# EAGLE design ESP32 IN14 Clock (EAGLE 8.2.1)

## Sheet 1 of 3
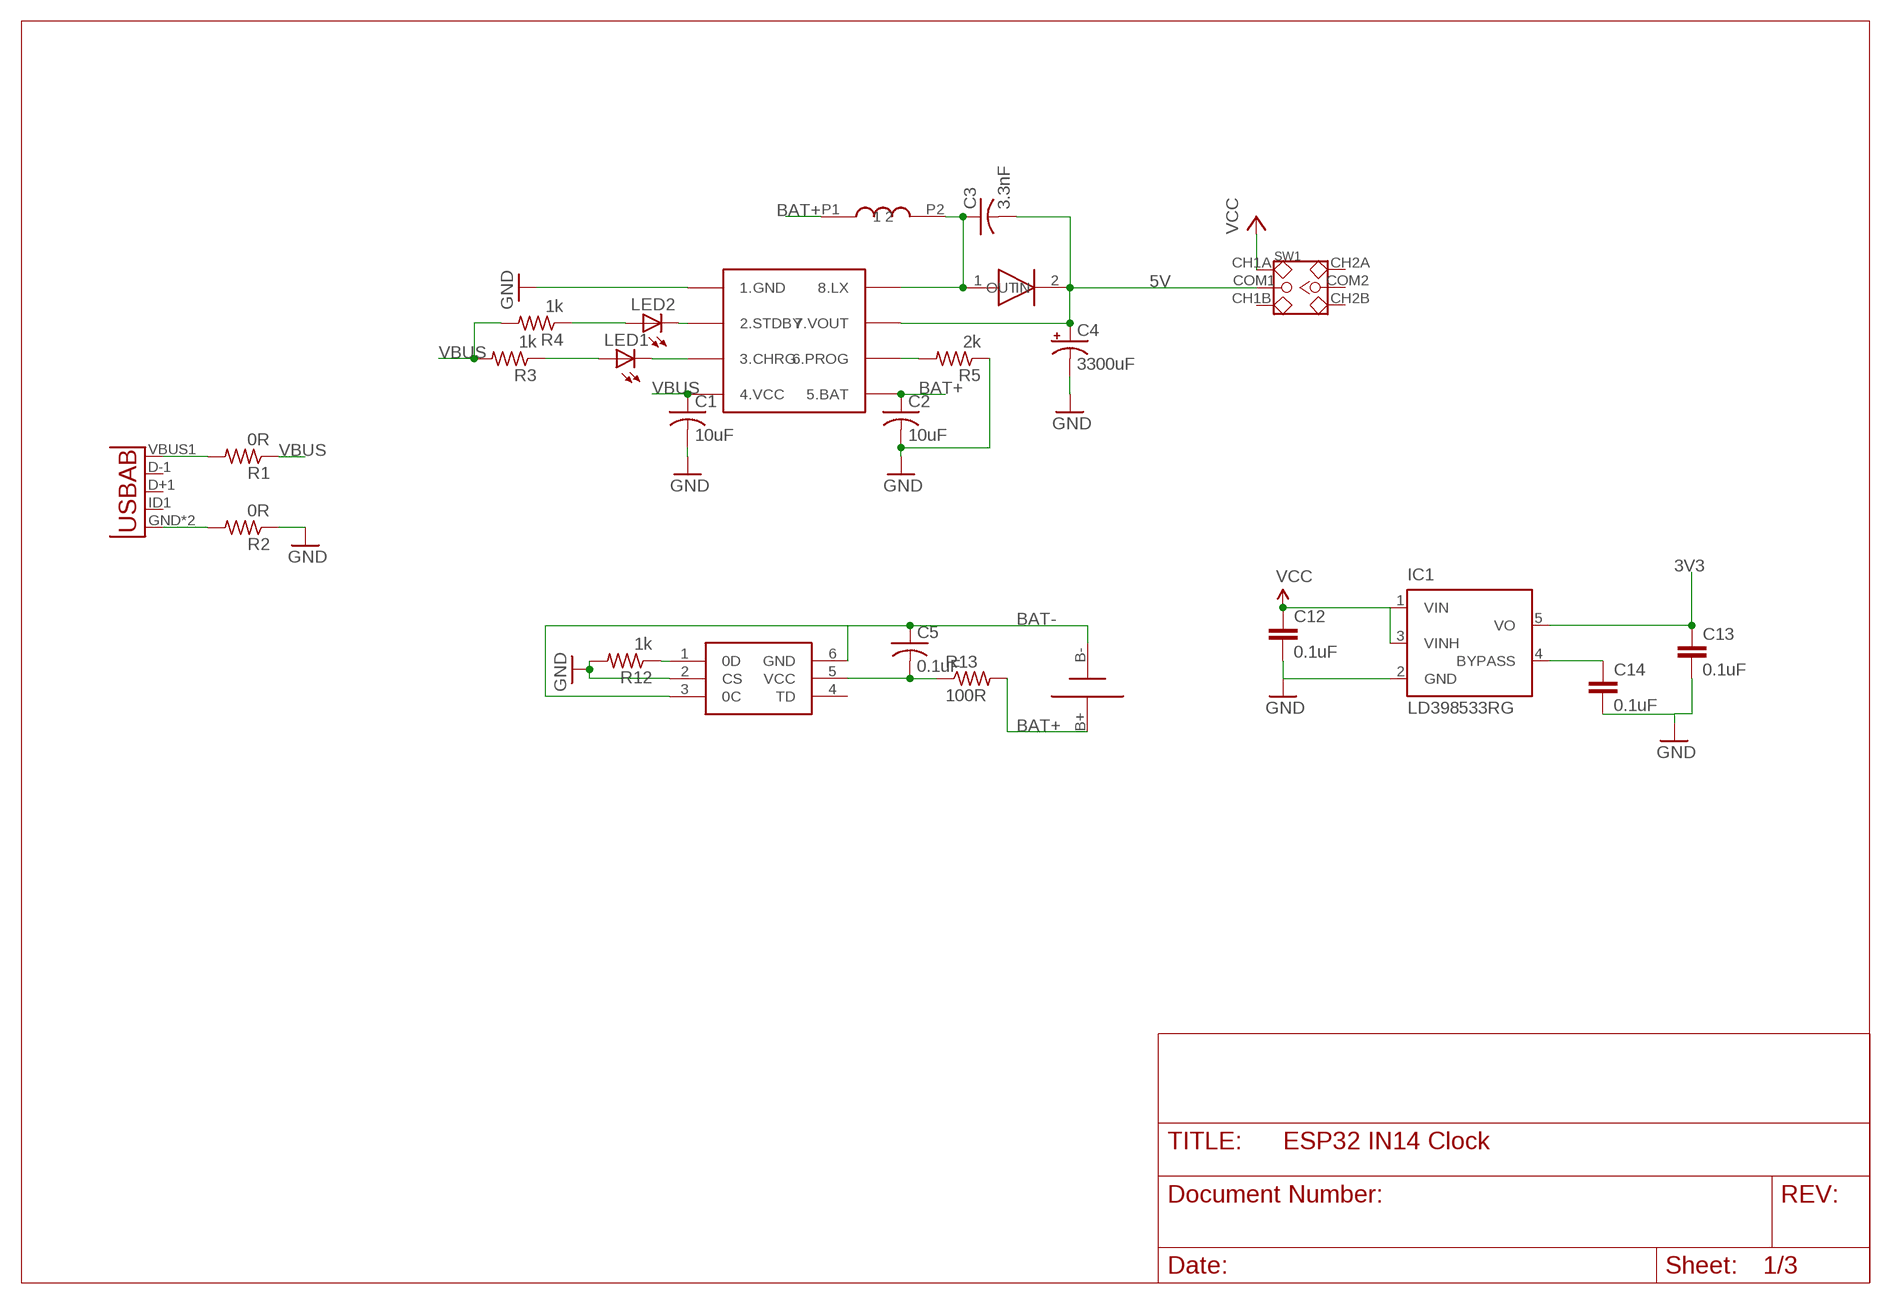
[diagram p0: schematic, sheet 1]

### Parts
C1  10uF  C-USC1206  [C1206]
C2  10uF  C-USC1206  [C1206]
C3  3.3nF  C-USC1206  [C1206]
C4  3300uF  CPOL-USE7.5-18  [E7,5-18]
C5  0.1uF  C-USC1206  [C1206]
C12  0.1uF  2.2UF-CERCAP-10009  [1206]
C13  0.1uF  2.2UF-CERCAP-10009  [1206]
C14  0.1uF  2.2UF-CERCAP-10009  [1206]
IC1  LD398533RG  [TSOT23-5L]
L2  3.3uH  CD54  [CD54]
LED1  LEDCHIPLED_0805  [CHIPLED_0805]
LED2  LEDCHIPLED_0805  [CHIPLED_0805]
R1  0R  R-US_M0805  [M0805]
R2  0R  R-US_M0805  [M0805]
R3  1k  R-US_M0805  [M0805]
R4  1k  R-US_M0805  [M0805]
R5  2k  R-US_M0805  [M0805]
R12  1k  R-US_M0805  [M0805]
R13  100R  R-US_M0805  [M0805]
SW1  SMD-TOGGLE-SWITCH-2CH(2X3P-7X3.5MM)  [SW6-2.54-SMD-7.0X3.5X1.5MM]
U1  USB""  [USB-MICRO-SMD]
U2  FM6316FE  [SOP-8]
U3  DW06  [SOT23-6]
U$1  SMA-SS34  [SMA-SS34]
U$2  18650SMD  [18650SMD]

### Nets
3V3: C13.1 IC1.5(VO) ; also sheet 2
5V: C3.2 C4.+ SW1.COM1 U2.7(7.VOUT) U$1.2(OUT)
BAT+: C2.1 L2.P1 R13.2 U2.5(5.BAT) U$2.B+
BAT-: C5.1 U3.3(0C) U3.6(GND) U$2.B-
GND: C1.2 C2.2 C4.- C12.2 C13.2 C14.2 IC1.2(GND) R2.1 R5.1 R12.2 U2.1(1.GND) U3.2(CS) ; also sheet 2,3
N$1: R1.2 U1.VBUS1(VBUS)
N$2: R2.2 U1.GND U1.GND1(GND)
N$3: LED1.C U2.3(3.CHRG)
N$4: LED1.A R3.1
N$5: LED2.C U2.2(2.STDBY)
N$6: R5.2 U2.6(6.PROG)
N$7: C3.1 L2.P2 U2.8(8.LX) U$1.1(IN)
N$8: R12.1 U3.1(0D)
N$9: C5.2 R13.1 U3.5(VCC)
N$13: C14.1 IC1.4(BYPASS)
N$18: LED2.A R4.1
VBUS: C1.1 R1.1 R3.2 R4.2 U2.4(4.VCC)
VCC: C12.1 IC1.1(VIN) IC1.3(VINH) SW1.CH1A ; also sheet 2,3
Unconnected: SW1.CH1B SW1.CH2A SW1.CH2B SW1.COM2 U1.D+1(D+) U1.D-1(D-) U1.ID1(USBID) U3.4(TD)

## Sheet 2 of 3
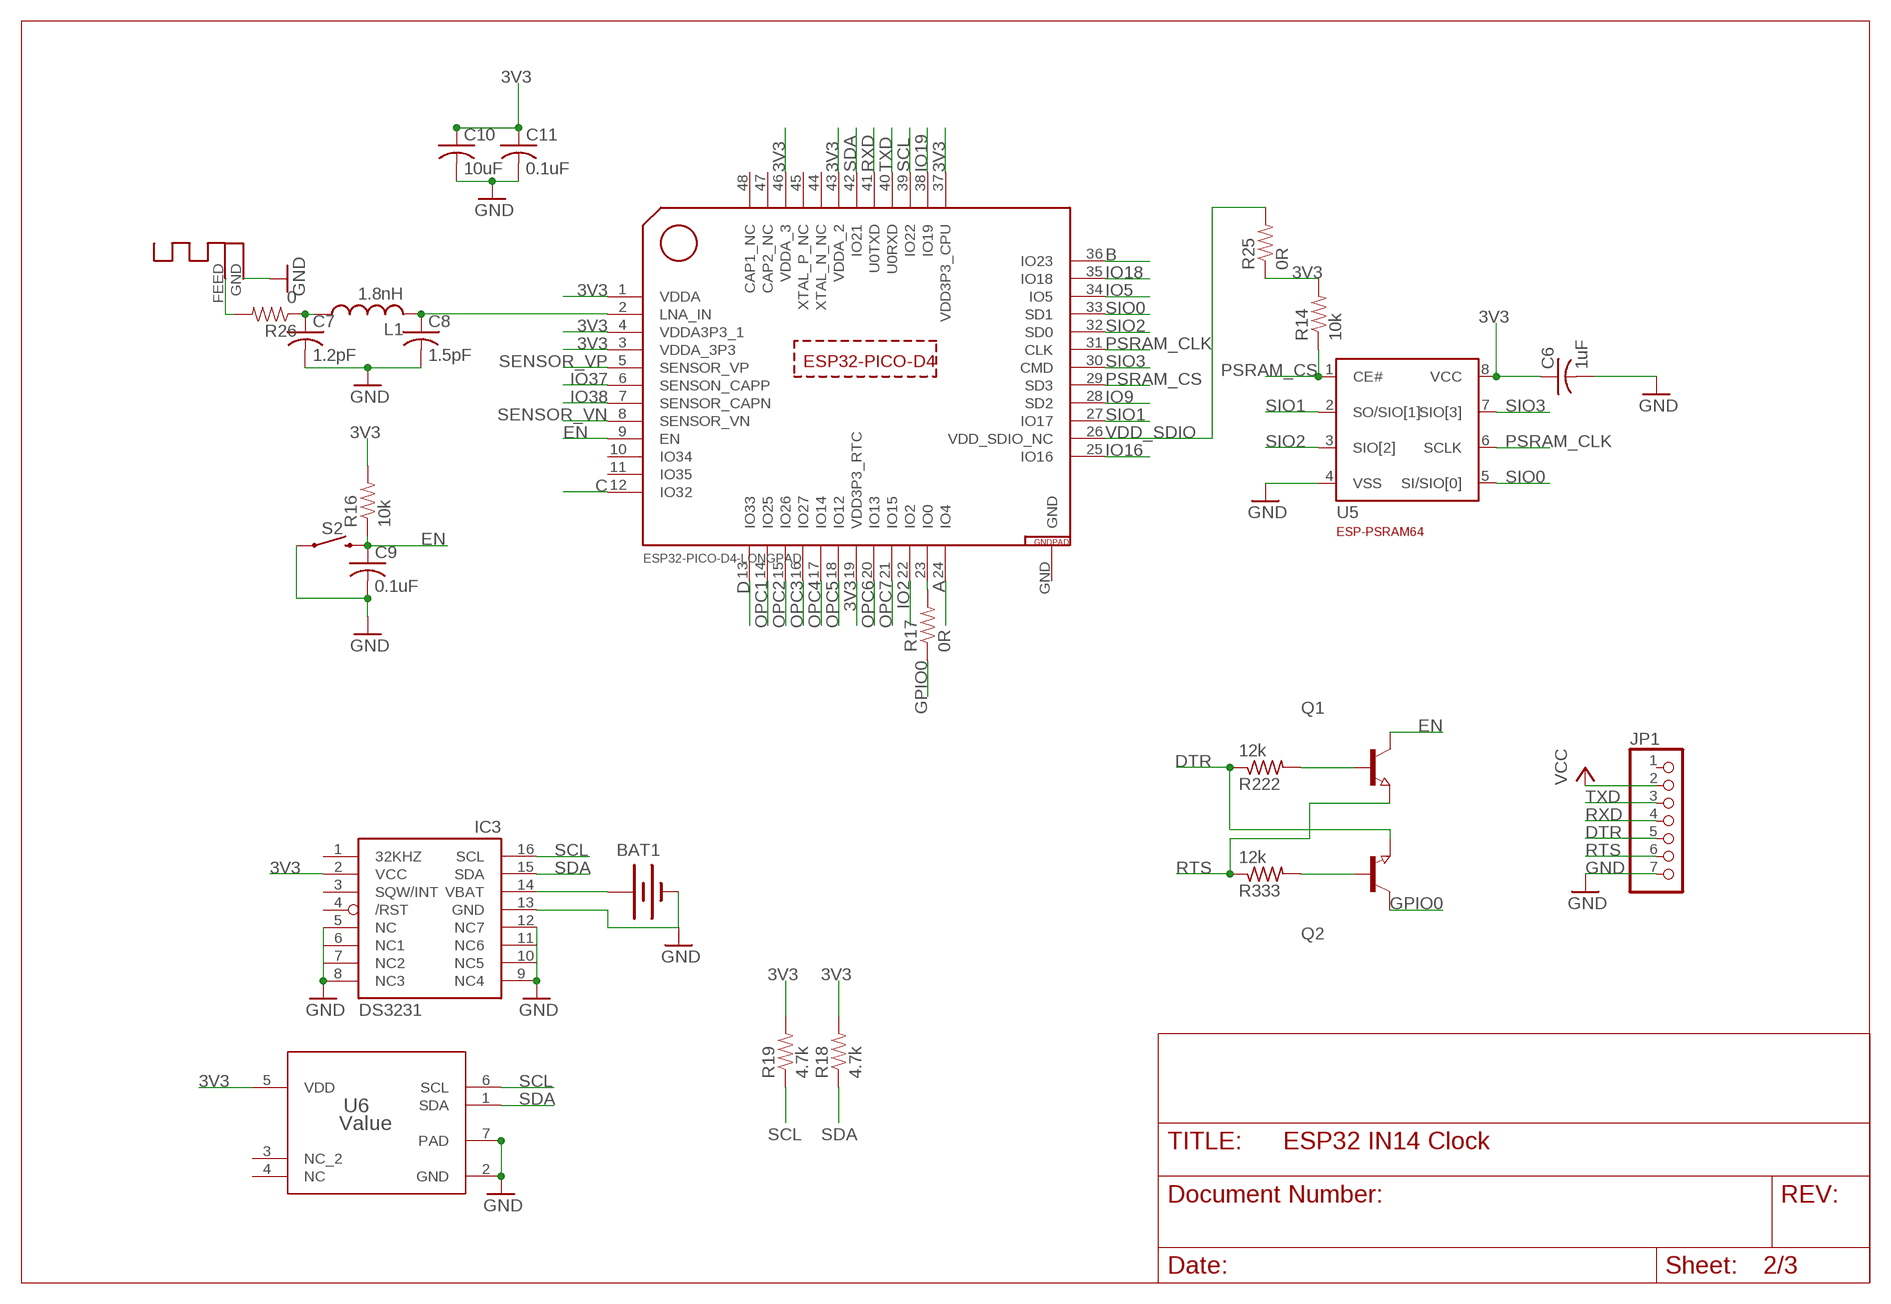
[diagram p1: schematic, sheet 2]

### Parts
ANT1  ANTENNA  [RN-ANT]
BAT1  BATTERY20PTH  [BATTCOM_20MM_PTH]
C6  1uF  C-USC1206  [C1206]
C7  1.2pF  C-USC1206  [C1206]
C8  1.5pF  C-USC1206  [C1206]
C9  0.1uF  C-USC1206  [C1206]
C10  10uF  C-USC1206  [C1206]
C11  0.1uF  C-USC1206  [C1206]
IC3  DS3231/SO  [SO16W]
JP1  PINHD-1X7  [1X07]
L1  1.8nH  INDUCTOR_0805_L  [RESC0805_L]
Q1  NPN-TRANSISTOR_SOT23W  [SOT23W]
Q2  NPN-TRANSISTOR_SOT23W  [SOT23W]
R14  10k  100OHM1/10W1%(0603)  [0603-RES]
R16  10k  100OHM1/10W1%(0603)  [0603-RES]
R17  0R  100OHM1/10W1%(0603)  [0603-RES]
R18  4.7k  1.2MOHMS-1/10W-1%(0603)  [0603-RES]
R19  4.7k  1.2MOHMS-1/10W-1%(0603)  [0603-RES]
R25  0R  100OHM1/10W1%(0603)  [0603-RES]
R26  0  100OHM1/10W1%(0603)  [0603-RES]
R222  12k  R-US_M0805  [M0805]
R333  12k  R-US_M0805  [M0805]
S2  MOMENTARY-SWITCH-SPST-SMD-6.0X3.5MM  [TACTILE_SWITCH_SMD_6.0X3.5MM]
U4  ESP32-PICO-D4-LONGPAD  [QFN48]
U5  ESP-PSRAM64  [SOT23-8]
U6  Value  HDC1080DMBR  [DMB0006A]

### Nets
3V3: C6.1 C10.1 C11.1 IC3.2(VCC) R14.2 R16.2 R18.2 R19.2 R25.1 U4.1(VDDA) U4.3(VDDA_3P3) U4.4(VDDA3P3_1) U4.19(VDD3P3_RTC) U4.37(VDD3P3_CPU) U4.43(VDDA_2) U4.46(VDDA_3) U5.8(VCC) U6.5(VDD) ; also sheet 1
A: U4.24(IO4) ; also sheet 3
B: U4.36(IO23) ; also sheet 3
C: U4.12(IO32) ; also sheet 3
D: U4.13(IO33) ; also sheet 3
DTR: JP1.5 Q2.3(E) R222.1
EN: C9.1 Q1.2(C) R16.1 S2.2 U4.9(EN)
GND: ANT1.GND BAT1.2(-) C6.2 C7.2 C8.2 C9.2 C10.2 C11.2 IC3.5(NC) IC3.6(NC1) IC3.7(NC2) IC3.8(NC3) IC3.9(NC4) IC3.10(NC5) IC3.11(NC6) IC3.12(NC7) IC3.13(GND) JP1.7 S2.1 U5.4(VSS) U6.2(GND) U6.7(PAD) ; also sheet 1,3
GPIO0: Q2.2(C) R17.1
IO2: U4.22(IO2)
IO5: U4.34(IO5)
IO9: U4.28(SD2)
IO16: U4.25(IO16)
IO18: U4.35(IO18)
IO19: U4.38(IO19)
IO37: U4.6(SENSON_CAPP)
IO38: U4.7(SENSOR_CAPN)
N$10: ANT1.FEED R26.2
N$11: R17.2 U4.23(IO0)
N$12: Q1.1(B) R222.2
N$14: Q2.1(B) R333.2
N$15: C8.1 L1.2 U4.2(LNA_IN)
N$16: C7.1 L1.1 R26.1
N$17: BAT1.1(+) IC3.14(VBAT)
OPC1: U4.14(IO25) ; also sheet 3
OPC2: U4.15(IO26) ; also sheet 3
OPC3: U4.16(IO27) ; also sheet 3
OPC4: U4.17(IO14) ; also sheet 3
OPC5: U4.18(IO12) ; also sheet 3
OPC6: U4.20(IO13) ; also sheet 3
OPC7: U4.21(IO15) ; also sheet 3
PSRAM_CLK: U4.31(CLK) U5.6(SCLK)
PSRAM_CS: R14.1 U4.29(SD3) U5.1(CE#)
RTS: JP1.6 Q1.3(E) R333.1
RXD: JP1.4 U4.41(U0TXD)
SCL: IC3.16(SCL) R19.1 U4.39(IO22) U6.6(SCL)
SDA: IC3.15(SDA) R18.1 U4.42(IO21) U6.1(SDA)
SENSOR_VN: U4.8(SENSOR_VN)
SENSOR_VP: U4.5(SENSOR_VP)
SIO0: U4.33(SD1) U5.5(SI/SIO[0])
SIO1: U4.27(IO17) U5.2(SO/SIO[1])
SIO2: U4.32(SD0) U5.3(SIO[2])
SIO3: U4.30(CMD) U5.7(SIO[3])
TXD: JP1.3 U4.40(U0RXD)
VCC: JP1.2 ; also sheet 1,3
VDD_SDIO: R25.2 U4.26(VDD_SDIO_NC)
Unconnected: IC3.1(32KHZ) IC3.3(SQW/INT) IC3.4(/RST) JP1.1 U4.10(IO34) U4.11(IO35) U4.44(XTAL_N_NC) U4.45(XTAL_P_NC) U4.47(CAP2_NC) U4.48(CAP1_NC) U6.3(NC_2) U6.4(NC)

## Sheet 3 of 3
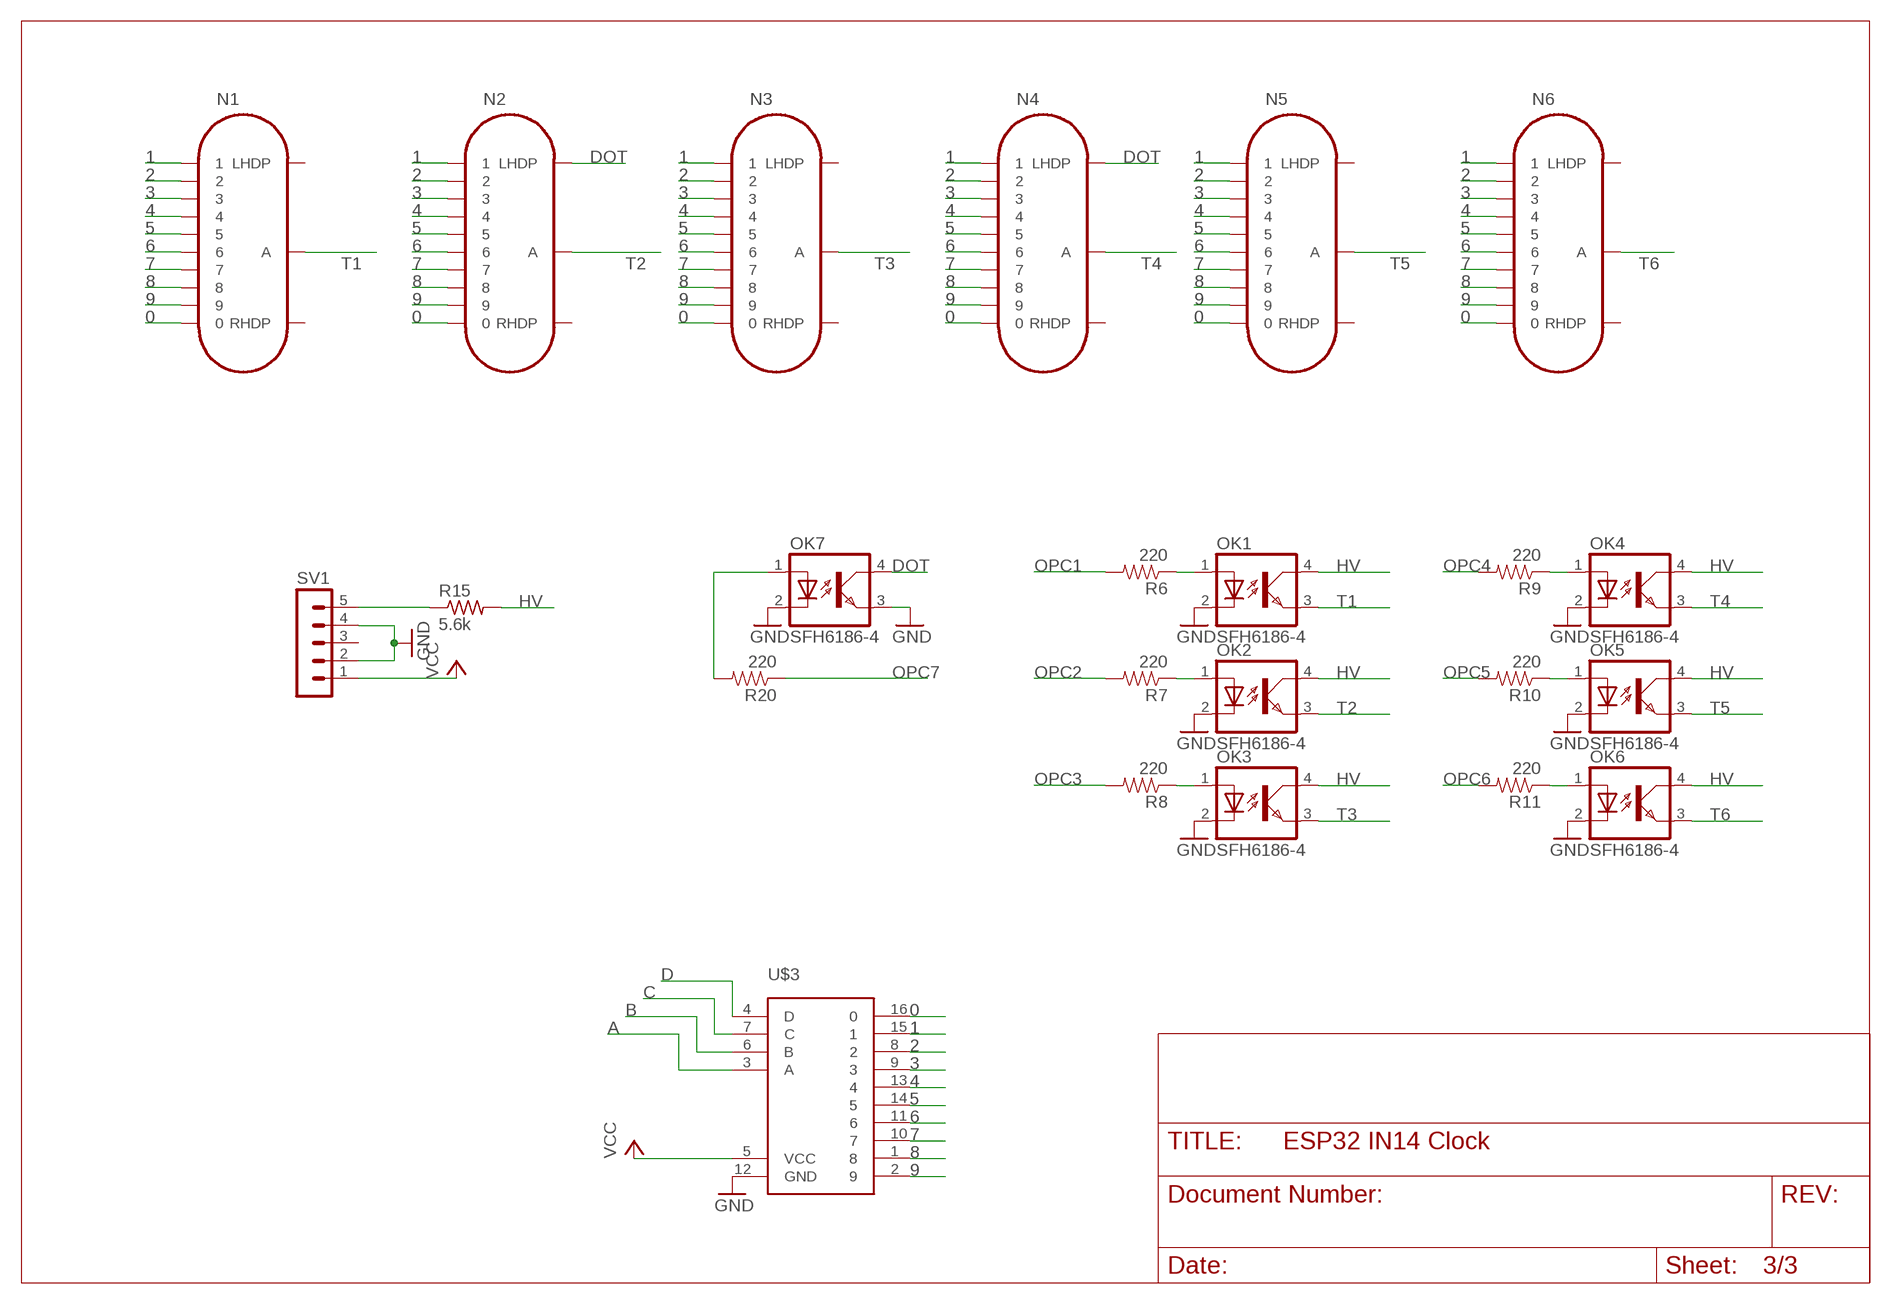
[diagram p2: schematic, sheet 3]

### Parts
N1  IN-14  [IN-14]
N2  IN-14  [IN-14]
N3  IN-14  [IN-14]
N4  IN-14  [IN-14]
N5  IN-14  [IN-14]
N6  IN-14  [IN-14]
OK1  SFH6186-4  [SMD4-7]
OK2  SFH6186-4  [SMD4-7]
OK3  SFH6186-4  [SMD4-7]
OK4  SFH6186-4  [SMD4-7]
OK5  SFH6186-4  [SMD4-7]
OK6  SFH6186-4  [SMD4-7]
OK7  SFH6186-4  [SMD4-7]
R6  220  1.2MOHMS-1/10W-1%(0603)  [0603-RES]
R7  220  1.2MOHMS-1/10W-1%(0603)  [0603-RES]
R8  220  1.2MOHMS-1/10W-1%(0603)  [0603-RES]
R9  220  1.2MOHMS-1/10W-1%(0603)  [0603-RES]
R10  220  1.2MOHMS-1/10W-1%(0603)  [0603-RES]
R11  220  1.2MOHMS-1/10W-1%(0603)  [0603-RES]
R15  5.6k  R-US_0207/12  [0207/12]
R20  220  1.2MOHMS-1/10W-1%(0603)  [0603-RES]
SV1  MA05-1  [MA05-1]
U$3  K155ID1  [DIL16-KIT]

### Nets
0: N1.0 N2.0 N3.0 N4.0 N5.0 N6.0 U$3.16
1: N1.1 N2.1 N3.1 N4.1 N5.1 N6.1 U$3.15
2: N1.2 N2.2 N3.2 N4.2 N5.2 N6.2 U$3.8
3: N1.3 N2.3 N3.3 N4.3 N5.3 N6.3 U$3.9
4: N1.4 N2.4 N3.4 N4.4 N5.4 N6.4 U$3.13
5: N1.5 N2.5 N3.5 N4.5 N5.5 N6.5 U$3.14
6: N1.6 N2.6 N3.6 N4.6 N5.6 N6.6 U$3.11
7: N1.7 N2.7 N3.7 N4.7 N5.7 N6.7 U$3.10
8: N1.8 N2.8 N3.8 N4.8 N5.8 N6.8 U$3.1
9: N1.9 N2.9 N3.9 N4.9 N5.9 N6.9 U$3.2
A: U$3.3(A) ; also sheet 2
B: U$3.6(B) ; also sheet 2
C: U$3.7(C) ; also sheet 2
D: U$3.4(D) ; also sheet 2
DOT: N2.LHDP N4.LHDP OK7.4(COL)
GND: OK1.2(C) OK2.2(C) OK3.2(C) OK4.2(C) OK5.2(C) OK6.2(C) OK7.2(C) OK7.3(EMIT) SV1.2 SV1.4 U$3.12(GND) ; also sheet 1,2
HV: OK1.4(COL) OK2.4(COL) OK3.4(COL) OK4.4(COL) OK5.4(COL) OK6.4(COL) R15.2
N$19: R15.1 SV1.5
N$22: OK1.1(A) R6.1
N$23: OK2.1(A) R7.1
N$24: OK3.1(A) R8.1
N$25: OK4.1(A) R9.1
N$26: OK5.1(A) R10.1
N$27: OK6.1(A) R11.1
N$40: OK7.1(A) R20.2
OPC1: R6.2 ; also sheet 2
OPC2: R7.2 ; also sheet 2
OPC3: R8.2 ; also sheet 2
OPC4: R9.2 ; also sheet 2
OPC5: R10.2 ; also sheet 2
OPC6: R11.2 ; also sheet 2
OPC7: R20.1 ; also sheet 2
T1: N1.A OK1.3(EMIT)
T2: N2.A OK2.3(EMIT)
T3: N3.A OK3.3(EMIT)
T4: N4.A OK4.3(EMIT)
T5: N5.A OK5.3(EMIT)
T6: N6.A OK6.3(EMIT)
VCC: SV1.1 U$3.5(VCC) ; also sheet 1,2
Unconnected: N1.LHDP N1.RHDP N2.RHDP N3.LHDP N3.RHDP N4.RHDP N5.LHDP N5.RHDP N6.LHDP N6.RHDP SV1.3

## Power pins joined to a net without a drawn wire
GND: U4.GND

## Library data of the parts
ANT1 = adafruit:ANTENNA
BAT1 = SparkFun-Electromechanical:BATTERY: Battery Holders Various common sizes : AA, AAA, 20mm coin cell and 12mm coin cell. 20MM_4LEGS, BATT-10373
C1-C3 C5-C11 = adafruit:C-US: CAPACITOR, American symbol
C4 = rcl:CPOL-US: POLARIZED CAPACITOR, American symbol; SPICEPREFIX: C
C12-C14 = SparkFun-Capacitors:2.2UF-CER: 2.2uF Ceramic SMT CAP-07888- 10V, 20% (0603) CAP-10009- 50V, 10% (1206); PROD_ID: CAP-10009; VALUE: 2.2uF
IC1 = st-microelectronics:LD3985: Ultra low drop and low noise BiCMOS voltage regulators Source: www.st.com LD3985.pdf
IC3 = adafruit:DS3231
JP1 = pinhead:PINHD-1X7: PIN HEADER
L1 = Nordic_nRF:INDUCTOR: Generic chip inductor
L2 = CD54:CD54
LED1 LED2 = adafruit:LED: LED OSRAM: - CHIPLED LG R971, LG N971, LY N971, LG Q971, LY Q971, LO R971, LY R971 LH N974, LH R974 LS Q976, LO Q976, LY Q976 LO Q996 - Hyper CHIPLED LW Q18S LB Q993, LB Q99A, LB R99A - SideLED LS A670, LO A670, LY A670, LG A670, LP A670 LB A673, LV A673, LT A673, LW A673 LH A674 LY A675 LS A676, LA A676, LO A676, LY A676, LW A676 LS A679, LY A679, LG A679 - Hyper Micro SIDELED® LS Y876, LA Y876, LO Y876, LY Y876 LT Y87S - SmartLED LW L88C, LW L88S LB L89C, LB L89S, LG L890 LS L89K, LO L89K, LY L89K LS L896, LA L896, LO L896, LY L896 - TOPLED LS T670, LO T670, LY T670, LG T670, LP T670 LSG T670, LSP T670, LSY T670, LOP T670, LYG T670 LG T671, LOG T671, LSG T671 LB T673, LV T673, LT T673, LW T673 LH T674 LS T676, LA T676, LO T676, LY T676, LB T676, LH T676, LSB T676, LW T676 LB T67C, LV T67C, LT T67C, LS T67K, LO T67K, LY T67K, LW E67C LS E67B, LA E67B, LO E67B, LY E67B, LB E67C, LV E67C, LT E67C LW T67C LS T679, LY T679, LG T679 LS T770, LO T770, LY T770, LG T770, LP T770 LB T773, LV T773, LT T773, LW T773 LH T774 LS E675, LA E675, LY E675, LS T675 LS T776, LA T776, LO T776, LY T776, LB T776 LHGB T686 LT T68C, LB T68C - Hyper Mini TOPLED® LB M676 - Mini TOPLED Santana® LG M470 LS M47K, LO M47K, LY M47K Source: http://www.osram.convergy.de/
N1-N6 = russian-nixies:IN-14: IN-14: medium numeric frontview nixie tube
OK1-OK7 = optocoupler:SFH618?*: Optocoupler, Phototransistor Output, Low Input Current Source: Data sheet <http://www.vishay.com/docs/83673/sfh618.pdf>; MF: VISHAY/TELEFUNKEN; MPN: SFH6186-4; OC_FARNELL: 1469530; OC_NEWARK: 21H7753
Q1 Q2 = semicon-smd-ipc:NPN-TRANSISTOR_: NPN TRANSISTOR
R1-R5 R12 R13 R222 R333 = adafruit:R-US_: RESISTOR, American symbol
R6-R11 R18-R20 = SparkFun-Resistors:1.2MOHMS-1/10W-1%(0603): RES-10055; PROD_ID: RES-10055; VALUE: 1.2M
R14 R16 R17 R25 R26 = SparkFun-Resistors:100OHM1/10W1%(0603): RES-07863; PROD_ID: RES-07863; VALUE: 100
R15 = resistor:R-US_: RESISTOR, American symbol
S2 = SparkFun-Switches:MOMENTARY-SWITCH-SPST: Momentary Switch (Pushbutton) - SPST Normally-open (NO) SPST momentary switches (buttons, pushbuttons). Variants PTH-12MM - 12mm square, through-hole Momentary Pushbutton Switch - 12mm Square <https://www.sparkfun.com/products/9190> (COM-09190) PTH-6.0MM, PTH-6.0MM-KIT - 6.0mm square, through-hole Mini Pushbutton Switch <https://www.sparkfun.com/products/97> (COM-00097) KIT package intended for soldering kit's - only one side of pads' copper is exposed. PTH-RIGHT-ANGLE-KIT - Right-angle, through-hole Right Angle Tactile Button <https://www.sparkfun.com/products/10791> - Used on SparkFun BigTime Watch Kit <https://www.sparkfun.com/products/11734> SMD-12MM - 12mm square, surface-mount Tactile Button - SMD (12mm) <https://www.sparkfun.com/products/12993> (COM-12993) Used on SparkFun PicoBoard <https://www.sparkfun.com/products/11888> SMD-4.5MM - 4.5mm Square Trackball Switch Used on SparkFun Blackberry Trackballer Breakout <https://www.sparkfun.com/products/13169> SMD-4.6MMX2.8MM - 4.60mm x 2.80mm, surface mount Used on SparkFun SAMD21 Mini Breakout <https://www.sparkfun.com/products/13664> SMD-5.2MM, SMD-5.2-REDUNDANT - 5.2mm square, surface-mount Mini Pushbutton Switch - SMD <https://www.sparkfun.com/products/8720> (COM-08720) Used on Arduino Pro Mini <https://www.sparkfun.com/products/11114> REDUNDANT package connects both switch circuits together SMD-6.0X3.5MM - 6.0 x 3.5mm, surface mount Momentary Reset Switch SMD <https://www.sparkfun.com/products/8229> (COM-08229) SMD-6.2MM-TALL - 6.2mm square, surface mount Tactile Button - SMD (6mm) <https://www.sparkfun.com/products/12992> Used on SparkFun Digital Sandbox <https://www.sparkfun.com/products/12651> SMD-RIGHT-ANGLE - Right-angle, surface mount Used on SparkFun Block for Intel® Edison - Arduino <https://www.sparkfun.com/products/13036>; PROD_ID: SWCH-14278; SF_SKU: COM-08229
SV1 = con-lstb:MA05-1: PIN HEADER; OC_FARNELL: unknown; OC_NEWARK: unknown
SW1 = Seeed-OPL-Switch:SMD-TOGGLE-SWITCH-2CH(2X3P-7X3.5MM): 311030005
U1 = MicroUSB Long GND:USB: This is a USB AB connector that is compatible with USB OTG. i.e. this connector can serve as a host or device
U2 = FM6316FE:FM6316FE
U3 = DW06:DW06: The DW01-P battery protection IC is designed to protect lithium-ion/polymer battery from damage or degrading the lifetime due to overcharge, overdischarge, and/or overcurrent for one-cell lithium-ion/polymer battery powered systems, such as cellular phones. Data sheet <http://goo.gl/4y108d> Dave.Calaway Eagle Library <https://goo.gl/Muy1Tr>
U4 = ESP32-PICO-D4-LongPAD:ESP32-PICO-D4-LONGPAD
U5 = ESP-PSRAM64:ESP-PSRAM64: ESP-PSRAM64
U6 = HDC1080:HDC1080DMBR; ALTERNATEPARTNUMBER: HDC1080DMBT; APPLICATION_BUILDNUMBER: *; COMPTYPE: IC; MANUFACTURER: Texas Instruments; MOUNTTYPE: SMT; PACKAGEREFERENCE: DMB0006A; PARTNUMBER: HDC1080DMBR; PIN_COUNT: 7; REFDES: RefDes; TYPE: TYPE
U$1 = SMA-SS34:SMA-SS34
U$2 = 18650SMD:18650SMD
U$3 = Nixie:K155ID1

## Board
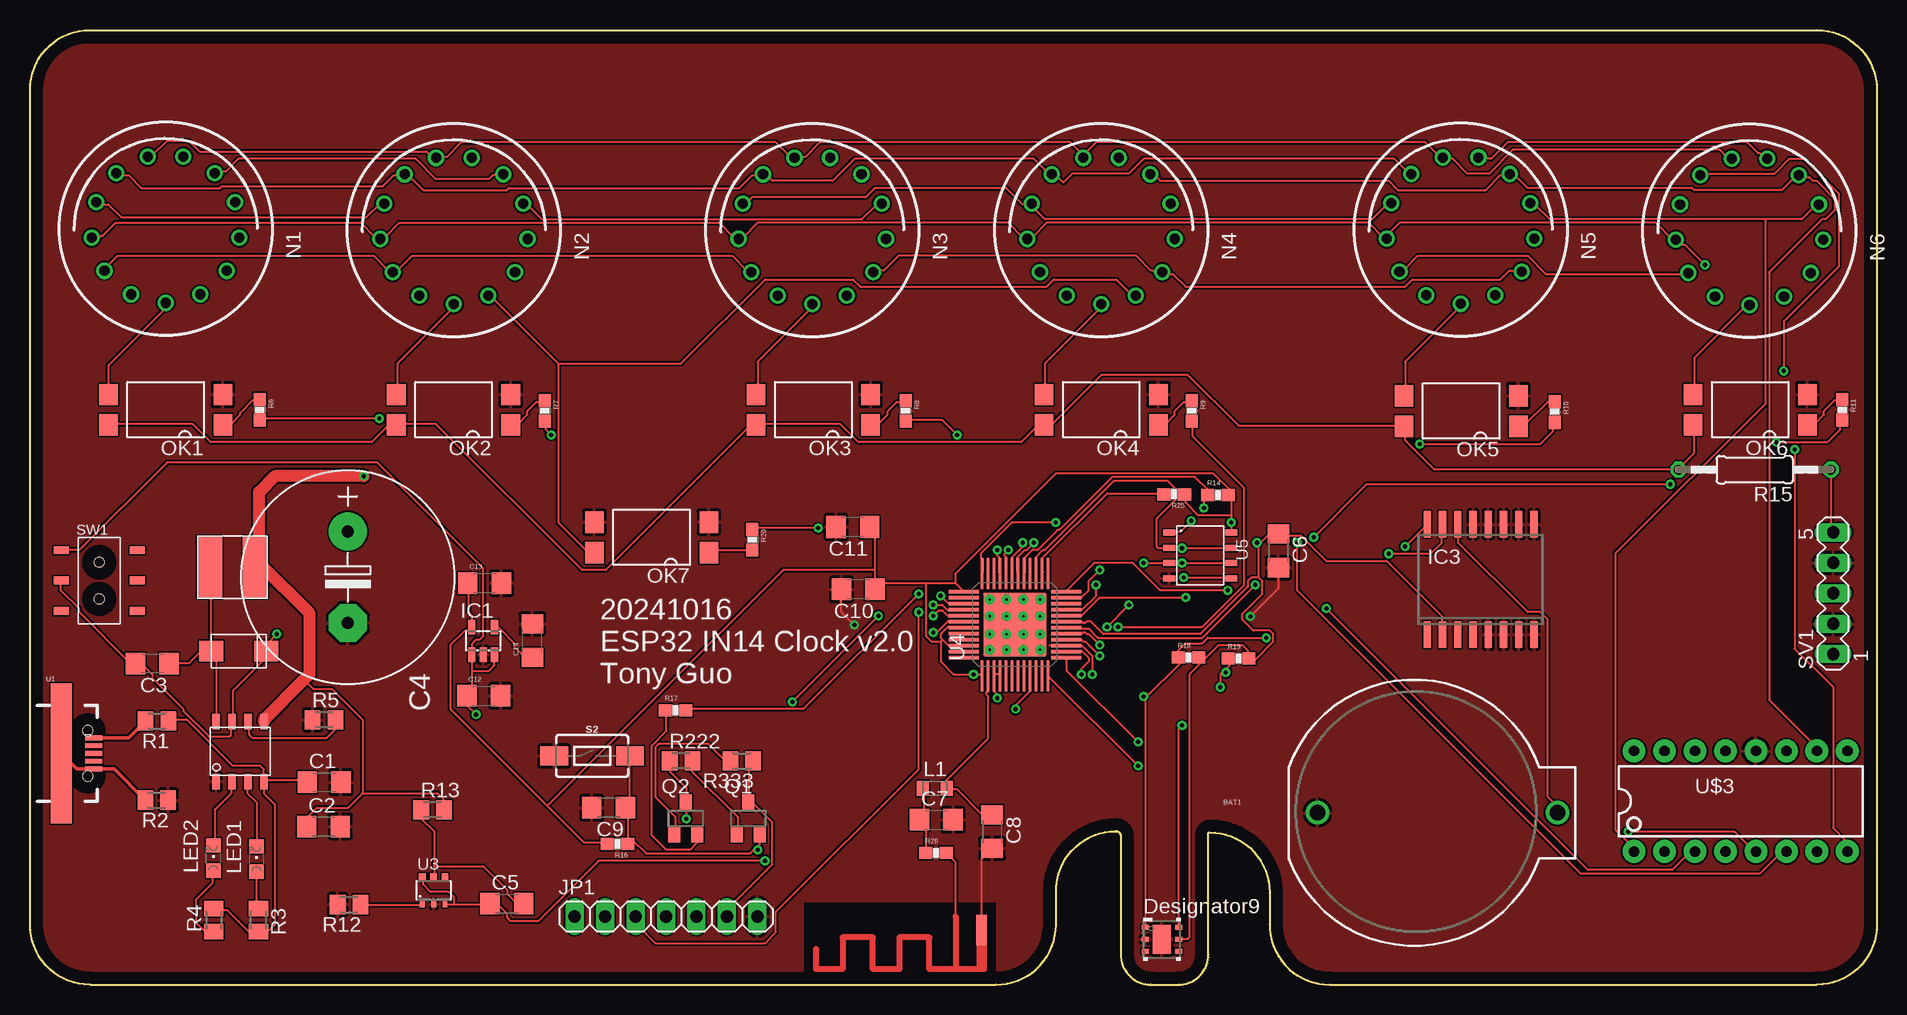
[diagram p3: board, top side]
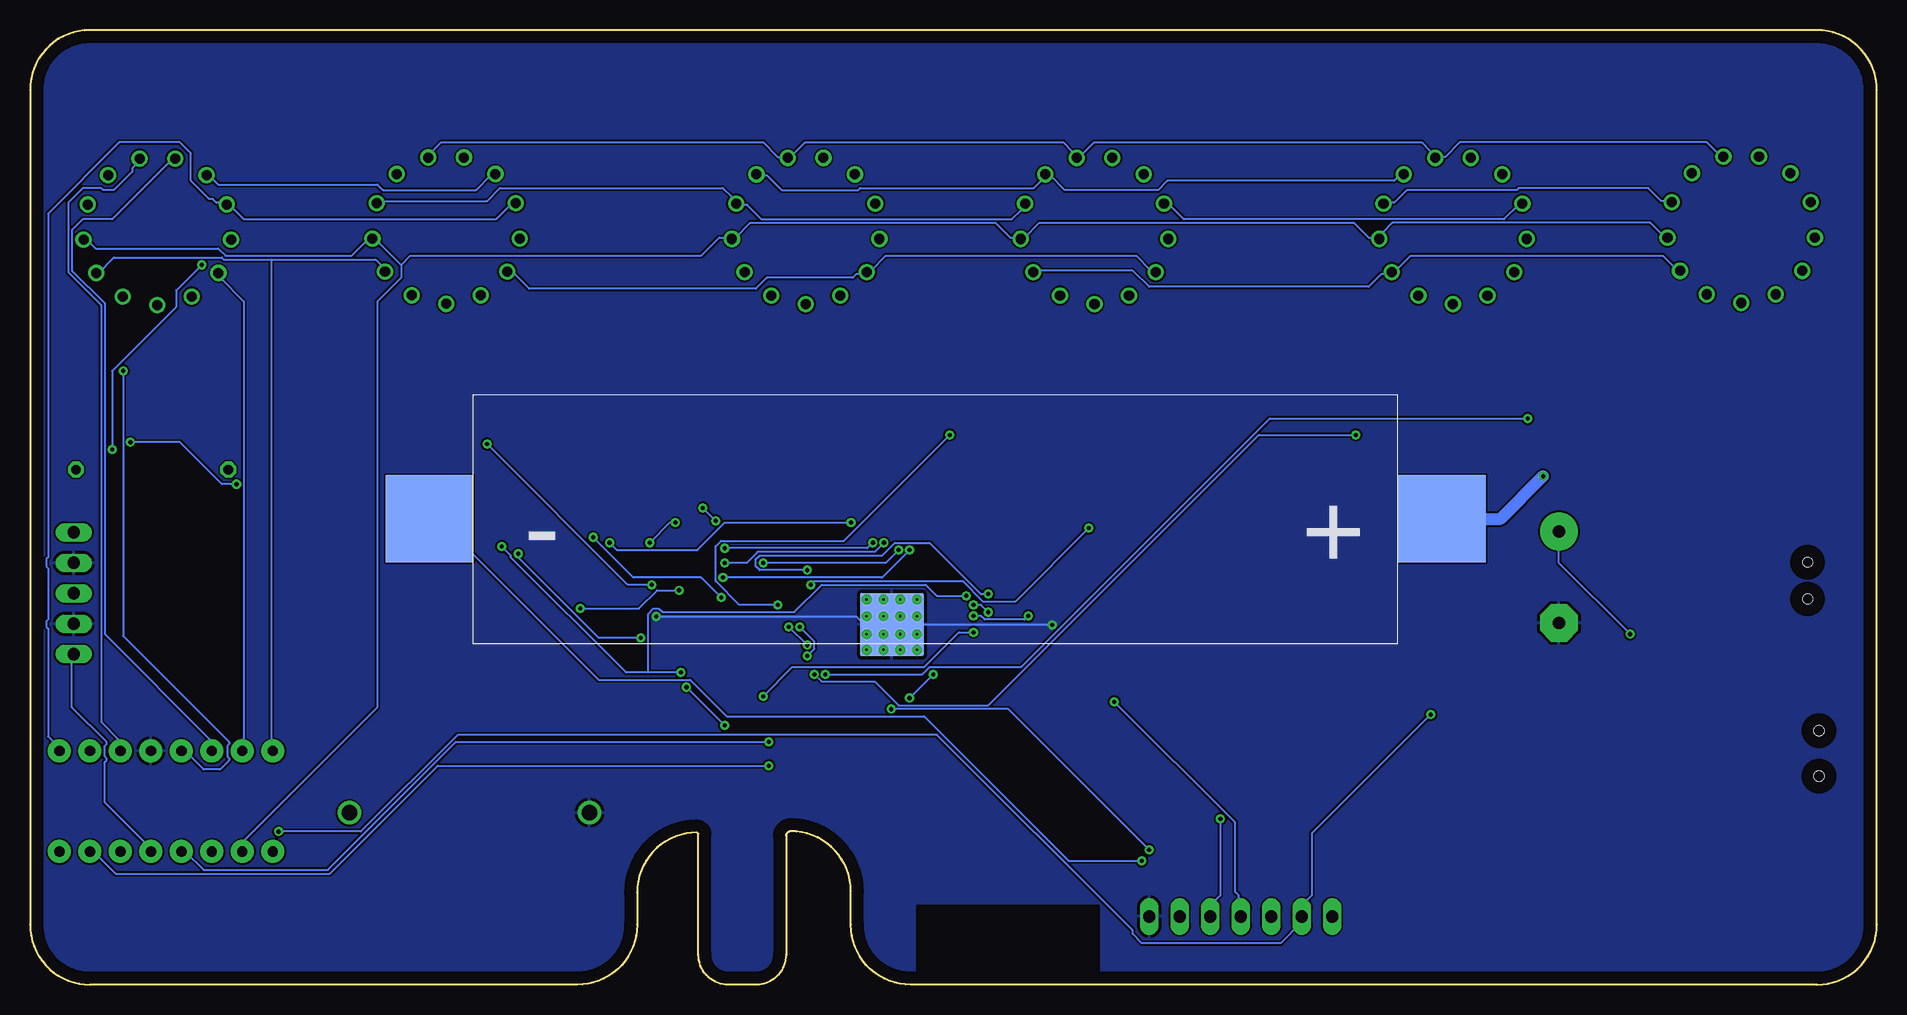
[diagram p4: board, bottom side, seen from below]

Size 153.9 x 79.6 mm. Coordinates in mm from the lower left corner, seen from the top.
Outline: 98.2,12.6 98.2,2.5 arc-90 95.7,0 93.4,0 arc-90 90.9,2.5 90.9,12.4 arc90 90.5,12.8 arc90 85.5,7.8 85.5,5 arc-90 80.5,0 5,0 arc-90 0,5 0,74.6 arc-90 5,79.6 148.9,79.6 arc-90 153.9,74.6 153.9,5 arc-90 148.9,0 108.3,0 arc-90 103.3,5 103.3,7.7 arc90 98.3,12.7
Copper layers (1*16): Top 0.035mm / dielectric 1.5mm / Bottom 0.035mm
Design rules "default": minimum track width 6mil, minimum drill 0.35mm, track to track 6mil, track to pad 6mil, pad to pad 6mil, via to via 6mil, smd to smd 6mil, copper to edge 40mil, drill to drill 6mil, minimum pad ring 10mil, minimum via ring 8mil, stop-mask expansion 4mil, vias tented up to drill 0mil, thermal gap 10mil
tRestrict: area 64.6,0.5 to 80.4,6.8
bRestrict: area 64.8,0.6 to 80,6.6

### Footprints (pad centres in the part's own frame; a part is rotated, then mirrored left to right if it is on the bottom)
RN-ANT = smd 0.025 x 0.025: FEED 0,2.159 | smd 2.54 x 0.889: GND -1.143,0
BATTCOM_20MM_PTH = drill 1.3: 1 11.85,0; 2 -8.15,0
C1206 = smd 1.6 x 1.8: 1 -1.4,0; 2 1.4,0
E7,5-18 = drill 1.016 pad 3.15: + -3.81,0 | drill 1.016 pad 3.15 octagon: - 3.81,0
1206 = smd 1.6 x 1.8: 1 -1.4,0; 2 1.4,0
TSOT23-5L = smd 0.6 x 1.2: 1 -0.95,-1.15; 2 0,-1.15; 3 0.95,-1.15; 4 0.95,1.15; 5 -0.95,1.15
SO16W = smd 0.6 x 2.2: 1 -4.445,-4.6; 2 -3.175,-4.6; 3 -1.905,-4.6; 4 -0.635,-4.6; 5 0.635,-4.6; 6 1.905,-4.6; 7 3.175,-4.6; 8 4.445,-4.6; 9 4.445,4.6; 10 3.175,4.6; 11 1.905,4.6; 12 0.635,4.6; 13 -0.635,4.6; 14 -1.905,4.6; 15 -3.175,4.6; 16 -4.445,4.6
1X07 = drill 1.016 long: 1 -7.62,0; 2 -5.08,0; 3 -2.54,0; 4 0,0; 5 2.54,0; 6 5.08,0; 7 7.62,0
RESC0805_L = smd 1 x 1.25: 1 -1,0; 2 1,0
CD54 = smd 5.2 x 2.1: P1 2.6,-1; P2 2.6,-4.8
CHIPLED_0805 = smd 1.2 x 1.2: A 0,-1.05; C 0,1.05
IN-14 = drill 0.84: 0 5.094,-3.516; 1 -5.094,-3.516; 2 -6.145,-0.746; 3 -5.788,2.195; 4 -4.105,4.633; 5 -1.481,6.01; 6 1.481,6.01; 7 4.105,4.633; 8 5.788,2.195; 9 6.145,-0.746; A 0,-6.19; LHDP 2.877,-5.481; RHDP -2.877,-5.481
SMD4-7 = smd 1.78 x 1.55: 1 -1.27,-4.77; 2 1.27,-4.77; 3 1.27,4.77; 4 -1.27,4.77
SOT23W = smd 1 x 1.4: 1 -0.95,-1.303; 2 0.95,-1.303; 3 0,1.303
M0805 = smd 1.3 x 1.6: 1 -0.95,0; 2 0.95,0
0603-RES = smd 1.1 x 1: 1 -0.85,0; 2 0.85,0
0207/12 = drill 0.813 octagon: 1 -6.35,0; 2 6.35,0
TACTILE_SWITCH_SMD_6.0X3.5MM = smd 2.3 x 1.6: 1 -3.15,0; 2 3.15,0
MA05-1 = drill 1.016 long: 1 -5.08,0; 2 -2.54,0; 3 0,0; 4 2.54,0; 5 5.08,0
SW6-2.54-SMD-7.0X3.5X1.5MM = smd 1.27 x 0.635: CH1A -3.175,2.54; CH1B -3.175,-2.54; CH2A 3.175,2.54; CH2B 3.175,-2.54; COM1 -3.175,0; COM2 3.175,0 | hole 0.813: 0,1.524; 0,-1.524
USB-MICRO-SMD = smd 1.4 x 0.4: D+1 2.7,0; D-1 2.7,0.65; GND1 2.7,-1.3; ID1 2.7,-0.65; VBUS1 2.7,1.3 | smd 1.778 x 11.684: GND 0,0 | hole 0.85: 2.2,1.9; 2.2,-1.9
SOP-8 = smd 1.27 x 0.635: 1 -2.5,2; 2 -2.5,0.67; 3 -2.5,-0.67; 4 -2.5,-2; 5 2.5,-2; 6 2.5,-0.67; 7 2.5,0.67; 8 2.5,2
SOT23-6 = smd 0.4 x 0.55: 1 -0.95,-1.15; 2 0,-1.15; 3 0.95,-1.15 | smd 0.55 x 0.55: 4 0.95,1.15; 5 0,1.15; 6 -0.95,1.15
QFN48 = smd 2.6 x 0.3: 1 -4.275,2.75; 2 -4.275,2.25; 3 -4.275,1.75; 4 -4.275,1.25; 5 -4.275,0.75; 6 -4.275,0.25; 7 -4.275,-0.25; 8 -4.275,-0.75; 9 -4.275,-1.25; 10 -4.275,-1.75; 11 -4.275,-2.25; 12 -4.275,-2.75; 25 4.275,-2.75; 26 4.275,-2.25; 27 4.275,-1.75; 28 4.275,-1.25; 29 4.275,-0.75; 30 4.275,-0.25; 31 4.275,0.25; 32 4.275,0.75; 33 4.275,1.25; 34 4.275,1.75; 35 4.275,2.25; 36 4.275,2.75 | smd 0.3 x 2.6: 13 -2.75,-4.275; 14 -2.25,-4.275; 15 -1.75,-4.275; 16 -1.25,-4.275; 17 -0.75,-4.275; 18 -0.25,-4.275; 19 0.25,-4.275; 20 0.75,-4.275; 21 1.25,-4.275; 22 1.75,-4.275; 23 2.25,-4.275; 24 2.75,-4.275; 37 2.75,4.275; 38 2.25,4.275; 39 1.75,4.275; 40 1.25,4.275; 41 0.75,4.275; 42 0.25,4.275; 43 -0.25,4.275; 44 -0.75,4.275; 45 -1.25,4.275; 46 -1.75,4.275; 47 -2.25,4.275; 48 -2.75,4.275 | smd 5.309 x 5.309: EXP 0,0 | smd 5.309 x 5.309 bottom: GND 0,0 | drill 0.2 pad 0.813: P$1 -2.1,-2.1; P$2 -2.1,-0.7; P$3 -2.1,0.7; P$4 -2.1,2.1; P$5 -0.8,-2.1; P$6 -0.8,-0.7; P$7 -0.8,0.7; P$8 -0.8,2.1; P$9 0.7,-2.1; P$10 0.7,-0.7; P$11 0.7,0.7; P$12 0.7,2.1; P$13 2.1,2.1; P$14 2.1,0.7; P$15 2.1,-0.7; P$16 2.1,-2.1
SOT23-8 = smd 0.5 x 1: 1 -1.905,-2.58; 2 -0.635,-2.58; 3 0.635,-2.58; 4 1.905,-2.58; 5 1.905,2.58; 6 0.635,2.58; 7 -0.635,2.58; 8 -1.905,2.58
DMB0006A = smd 0.6 x 0.4: 1 -1.4,1; 2 -1.4,0; 3 -1.4,-1; 4 1.4,-1; 5 1.4,0; 6 1.4,1 | smd 1.5 x 2.4: 7 0,0 | smd 0.5 x 0.5: V -0.5,0
SMA-SS34 = smd 2 x 1.7: 1 0,-1.4; 2 4.6,-1.4
18650SMD = smd 7.3 x 7.3: B+ -3.7,10.3; B- 80.7,10.3
DIL16-KIT = drill 0.864 pad 1.905: 1 -8.89,-4.191; 2 -6.35,-4.191; 3 -3.81,-4.191; 4 -1.27,-4.191; 5 1.27,-4.191; 6 3.81,-4.191; 7 6.35,-4.191; 8 8.89,-4.191; 9 8.89,4.191; 10 6.35,4.191; 11 3.81,4.191; 12 1.27,4.191; 13 -1.27,4.191; 14 -3.81,4.191; 15 -6.35,4.191; 16 -8.89,4.191

### Placement (x,y rotation side)
ANT1  79.3,5.7 90 top
BAT1  115.44,14.34 0 top
C1  24.51,16.89 0 top
C2  24.46,13.19 0 top
C3  10.19,26.77 180 top
C4  26.49,33.98 270 top
C5  39.74,6.77 0 top
C6  104.03,36.17 270 top
C7  75.52,13.76 0 top
C8  80.17,12.76 270 top
C9  48.22,14.76 180 top
C10  69.02,32.96 180 top
C11  68.57,38.16 180 top
C12  37.81,24.09 0 top
C13  37.89,33.49 0 top
C14  41.87,28.69 90 top
IC1  37.76,28.67 0 top
IC3  120.89,33.79 0 top
JP1  53,5.69 0 top
L1  75.41,16.37 0 top
L2  19.77,37.41 270 top
LED1  18.88,10.49 0 top
LED2  15.28,10.57 0 top
N1  11.3,63.04 0 top
N2  35.32,62.93 0 top
N3  65.19,62.93 0 top
N4  89.26,62.93 0 top
N5  119.22,62.96 0 top
N6  143.29,62.86 0 top
OK1  11.3,47.94 90 top
OK2  35.29,47.94 90 top
OK3  65.28,47.94 90 top
OK4  89.27,47.94 90 top
OK5  119.26,47.84 90 top
OK6  143.35,47.94 90 top
OK7  51.8,37.3 90 top
Q1  59.86,13.86 0 top
Q2  54.64,13.86 0 top
R1  10.58,21.99 180 top
R2  10.56,15.39 180 top
R3  19.04,5.39 270 top
R4  15.32,5.39 90 top
R5  24.5,22.09 0 top
R6  19.16,47.95 270 top
R7  42.91,47.85 270 top
R8  72.96,47.85 270 top
R9  96.81,47.85 270 top
R10  127.06,47.75 270 top
R11  151.01,47.95 270 top
R12  26.6,6.69 180 top
R13  33.55,14.59 0 top
R14  99,40.84 0 top
R15  143.72,42.94 180 top
R16  48.95,11.74 180 top
R17  53.8,22.89 0 top
R18  96.55,27.29 0 top
R19  100.7,27.19 0 top
R20  60.2,37.1 270 top
R25  95.35,40.89 180 top
R26  75.5,10.99 0 top
R222  54.26,18.67 0 top
R333  59.31,18.67 180 top
S2  46.84,19.07 0 top
SV1  150.26,32.64 90 top
SW1  5.77,33.7 0 top
U1  2.61,19.29 0 top
U2  17.5,19.44 90 top
U3  33.64,7.87 0 top
U4  82.08,30.02 90 top
U5  97.51,35.79 270 top
U6  94.33,3.79 0 top
U$1  15.09,29.21 0 top
U$2  39.92,49.15 180 bottom
U$3  142.56,15.3 0 top

### Tracks (layer width: path | path; a pad name or v marks a point on that pad's centre or on a via)
0
  Top 0.152: N3.0 70.4,59.56 71.16,59.56 72.38,60.78 92.19,60.78 93.41,59.56 93.56,59.56 93.71,59.4 94.32,59.4 N4.0 94.47,59.4 94.63,59.25 95.24,59.25 96.3,58.19 114.59,58.19 115.2,58.79 122.52,58.79 123.28,59.56 124.19,59.56 N5.0
  Bottom 0.152: 133.79,60.47 137.76,60.47 137.91,60.62 146.9,60.62 148.27,59.25 N6.0 | 133.79,60.47 125.11,60.47 124.65,60.01 124.65,59.86 124.34,59.56 N5.0 | 133.79,60.47 133.79,20.54 133.64,20.39 133.64,19.63 U$3.16 | N1.0 16.45,59.56 16.75,59.86 16.9,59.86 17.82,60.78 38.85,60.78 40.07,59.56 40.37,59.56 N2.0 40.53,59.4 40.68,59.25 41.29,59.25 42.35,58.19 60.64,58.19 62.01,59.56 70.24,59.56 N3.0
1
  Top 0.152: N6.1 138.06,59.25 126.33,59.25 124.8,60.78 115.66,60.78 114.44,59.56 114.13,59.56 N5.1 | N1.1 6.08,59.56 7.3,60.78 28.64,60.78 29.86,59.56 30.16,59.56 N2.1 30.31,59.56 30.62,59.56 31.84,60.78 58.51,60.78 59.73,59.56 60.03,59.56 N3.1
  Bottom 0.152: U$3.15 136.23,19.63 136.23,20.39 136.08,20.54 136.08,56.97 138.06,58.95 138.06,59.25 N6.1 | N3.1 60.19,59.56 60.49,59.56 61.71,60.78 82.59,60.78 83.81,59.56 84.11,59.56 N4.1 84.26,59.4 84.42,59.25 85.03,59.25 85.33,58.95 92.49,58.95 93.41,58.03 112.31,58.03 113.68,59.4 113.98,59.4 N5.1
2  (via drill 0.35)
  Top 0.152: N1.2 5.78,62.3 5.93,62.45 6.08,62.45 7.15,63.52 27.57,63.52 28.79,62.3 29.1,62.3 N2.2 29.25,62.3 29.55,62.3 30.77,63.52 57.44,63.52 58.66,62.3 58.97,62.3 N3.2 59.12,62.3 59.42,62.3 60.64,63.52 81.52,63.52 82.74,62.3 83.05,62.3 N4.2 83.2,62.3 83.5,62.3 84.72,63.52 111.54,63.52 112.76,62.3 113.07,62.3 N5.2 113.22,62.3 113.22,62.6 114.13,63.52 135.47,63.52 136.99,62 N6.2 137.15,62 137.45,62 137.76,61.69 137.91,61.69 v139.59,60.01 | v147.05,44.62 147.05,28.01 150.25,24.81 150.25,13.07 151.32,12.01 151.32,11.25 U$3.8
  Bottom 0.152: v147.05,44.62 147.05,51.18 141.72,56.51 141.72,57.88 v139.59,60.01
3
  Top 0.152: N3.3 59.42,65.2 59.73,65.2 60.19,65.65 69.63,65.65 70.4,66.41 81.37,66.41 82.74,65.04 83.35,65.04 N4.3 83.5,65.04 83.81,64.74 83.81,64.59 84.57,63.82 111.85,63.82 113.07,65.04 113.37,65.04 N5.3 | N2.3 29.4,65.04 29.1,65.04 28.03,63.98 7.61,63.98 6.54,65.04 6.24,65.04 6.08,65.2 5.63,65.2 N1.3
  Bottom 0.152: N3.3 59.27,65.04 58.97,65.04 57.75,63.82 31.08,63.82 29.86,65.04 29.55,65.04 N2.3 | N5.3 113.52,65.04 113.83,65.04 115.05,63.82 136.08,63.82 137.45,65.2 N6.3 137.6,65.2 138.37,65.2 138.67,65.5 138.98,65.5 140.5,67.03 140.5,69.31 141.41,70.22 146.44,70.22 152.39,64.28 152.39,35.63 152.54,35.48 152.54,34.87 152.39,34.72 152.39,30.45 152.54,30.3 152.54,29.84 152.39,29.69 152.39,20.7 151.93,20.24 151.93,20.09 151.47,19.63 U$3.9
3V3  (via drill 0.35)
  Top 0.152: 43.12,14.9 35.04,22.98 35.04,28.31 36.26,29.53 36.72,29.53 36.87,29.69 IC1.5 36.87,29.84 36.87,30.75 36.56,31.06 36.56,33.34 C13.1 | 43.12,14.9 46.16,11.86 47.99,11.86 R16.2 | U4.4 80.76,25.88 80.45,25.88 U4.3 80.3,25.72 80.3,24.5 80.76,24.05 v80.61,23.9 | 76.03,28.77 75.88,28.92 75.88,29.23 76.49,29.84 77.71,29.84 U4.43 | 76.03,28.77 76.49,28.31 77.71,28.31 U4.46 | 75.88,28.62 75.88,26.94 76.95,25.88 v78.62,25.88 79.23,25.88 U4.1 | 76.03,28.77 75.88,28.62 | 70.4,34.56 70.4,37.76 70.09,38.07 C11.1 | 70.4,34.56 70.4,33.5 | 70.4,33.5 70.4,33.04 C10.1 70.4,33.5 | 77.1,33.5 77.71,32.89 U4.37 | 70.4,33.5 74.66,33.5 | 74.66,33.5 77.1,33.5 | 75.88,28.62 75.12,28.62 74.66,29.08 74.66,33.5 | 100.11,39.14 100.11,40.66 99.96,40.81 R14.2 99.96,40.96 99.96,41.27 98.59,42.64 85.48,42.64 77.1,34.26 77.1,33.5 | 100.11,39.14 v100.11,38.53 100.11,37.76 U5.8 | 100.11,39.14 97.37,39.14 96.3,40.2 96.3,40.81 R25.1 | 97.52,27.25 97.52,26.79 96.61,25.88 96.61,3.93 96.46,3.78 95.85,3.78 U6.5 | 97.52,27.25 97.98,27.25 99.05,28.31 101.03,28.31 101.48,27.86 101.48,27.25 R19.2 101.64,27.1 102.09,27.1 103.62,28.62 103.62,29.23 103.31,29.53 101.94,29.53 101.03,30.45 101.03,30.91 102.7,32.58 102.7,33.65 102.4,33.95 | 97.52,27.25 R18.2 | 102.4,36.7 103.16,37.46 103.92,37.46 C6.1 104.08,37.46 105.91,37.46 108.04,35.33 113.07,35.33 117.64,30.75 117.64,29.23 IC3.2 | 102.4,33.95 102.4,36.7 | 102.4,33.95 101.79,33.95 101.48,33.65 101.48,33.19 97.52,29.23 89.45,29.23 88.38,30.3 88.07,30.3 87.92,30.14 87.77,30.14 87.62,30.3 86.4,30.3 U4.19 | 102.4,36.7 v102.25,36.85 | 43.12,14.9 62.78,34.56 70.4,34.56
  Bottom 0.152: v78.62,25.88 v80.61,23.9 | v100.11,38.53 100.57,38.53 v102.25,36.85
4  (via drill 0.35)
  Top 0.152: N1.4 7.3,67.63 7.45,67.48 8.22,67.48 9.28,66.41 15.84,66.41 15.99,66.57 29.4,66.57 30.31,67.48 31.08,67.48 N2.4 31.23,67.48 31.53,67.48 32.75,66.26 39.76,66.26 39.92,66.41 59.12,66.41 60.19,67.48 60.95,67.48 N3.4 61.1,67.48 61.4,67.48 61.86,67.03 66.89,67.03 68.72,68.85 83.65,68.85 85.03,67.48 N4.4 85.18,67.48 85.48,67.48 86.09,66.87 86.86,67.63 91.58,67.63 92.8,68.85 113.68,68.85 115.05,67.48 N5.4 | v146.14,51.18 146.14,55.29 150.71,59.86 150.71,65.96 147.81,68.85 146.6,68.85 145.38,67.63 139.28,67.63 N6.4
  Bottom 0.152: N5.4 115.2,67.48 115.51,67.48 116.72,66.26 124.5,66.26 124.95,66.72 138.21,66.72 139.13,67.63 N6.4 | v146.14,51.18 146.14,29.08 137.3,20.24 137.3,20.09 137.45,19.93 137.45,19.02 137.3,18.87 137.3,18.71 138.06,17.95 139.43,17.95 140.96,19.48 141.26,19.48 U$3.13
5
  Top 0.152: N1.5 9.89,69.16 10.2,69.16 11.42,70.38 13.25,70.38 14.16,69.46 33.06,69.46 33.52,69.01 33.82,69.01 N2.5 33.97,69.01 34.73,69.01 35.95,70.22 62.17,70.22 63.38,69.01 63.69,69.01 N3.5 63.84,69.01 64.6,69.01 65.82,70.22 86.7,70.22 87.77,69.16 | 87.77,69.16 87.92,69.01 N4.5 87.77,69.16 | N6.5 141.72,69.01 141.41,69.01 140.8,69.62 123.58,69.62 121.6,67.63 119.77,67.63 118.55,68.85 117.79,68.85 N5.5 117.64,68.85 116.27,70.22 88.84,70.22 87.77,69.16
  Bottom 0.152: U$3.14 138.82,19.63 138.82,20.39 147.66,29.23 147.66,56.81 150.41,59.56 150.41,62.91 149.49,63.82 147.05,63.82 141.87,69.01 N6.5
5V  (via drill 0.35)
  Top 0.152: SW1.COM1 2.58,33.65 2.58,32.89 4.1,31.36 4.1,31.06 8.37,26.79 8.67,26.79 C3.2 8.83,26.64 9.44,26.64 10.2,25.88 10.2,25.57 12.79,22.98 12.79,22.83 14.92,20.7 16.6,20.7 16.75,20.85 16.75,21.91 U2.7 16.9,22.07 16.9,24.5 19.65,27.25 19.65,27.71 U$1.2 19.8,27.86 19.8,28.47 v20.56,29.23
  Bottom 0.152: v20.56,29.23 26.5,35.17 26.5,37.76 C4.+
6
  Top 0.152: N5.6 120.84,68.85 121.75,68.85 123.13,70.22 143.09,70.22 144.01,69.31 144.16,69.31 144.46,69.01 144.77,69.01 N6.6
  Bottom 0.152: N1.6 12.79,69.16 13.09,69.16 14.16,70.22 34.73,70.22 35.95,69.01 36.72,69.01 N2.6 36.87,69.01 37.17,69.31 37.17,69.46 37.93,70.22 65.21,70.22 66.59,68.85 N3.6 66.74,69.01 67.04,69.31 67.04,69.46 67.8,70.22 89.29,70.22 90.66,68.85 N4.6 90.82,69.01 91.58,69.01 92.8,70.22 119.62,70.22 120.84,69.01 N5.6 | U$3.11 146.44,19.63 146.44,20.39 147.97,21.91 147.97,56.66 150.71,59.4 150.71,65.2 149.49,66.41 147.97,66.41 147.81,66.26 146.9,66.26 145.38,67.79 145.38,68.09 144.92,68.55 144.92,68.85 N6.6
7
  Top 0.152: U$3.10 148.88,19.63 148.42,20.09 148.42,20.24 144.92,23.74 144.92,59.4 149.34,63.82 149.64,63.82 150.41,64.59 150.41,65.5 148.88,67.03 148.58,67.03 148.27,67.33 147.66,67.33 147.51,67.48 N6.7 147.36,67.63 145.99,66.26 138.67,66.26 138.52,66.41 124.8,66.41 123.74,67.48 123.43,67.48 N5.7 123.28,67.48 122.52,67.48 121.3,66.26 113.98,66.26 113.22,67.03 94.17,67.03 93.71,67.48 93.41,67.48 N4.7 | N1.7 15.53,67.79 16.29,67.79 17.36,68.85 32.14,68.85 33.82,67.18 38.24,67.18 38.54,67.48 39.31,67.48 N2.7
  Bottom 0.152: N4.7 93.26,67.48 92.49,67.48 91.27,66.26 84.87,66.26 84.72,66.41 70.24,66.41 69.63,67.03 69.63,67.18 69.33,67.48 N3.7 69.18,67.48 68.87,67.48 67.65,66.26 59.88,66.26 59.12,67.03 40.22,67.03 39.76,67.48 39.46,67.48 N2.7
8
  Top 0.152: N3.8 70.85,65.04 70.55,65.04 69.33,63.82 42.66,63.82 41.44,65.04 41.14,65.04 N2.8 | 144.61,63.82 147.66,63.82 149.03,65.2 N6.8 | 144.61,63.82 126.63,63.82 125.41,65.04 125.11,65.04 N5.8 | 144.61,63.82 144.61,48.43 132.12,35.93 132.12,12.92 133.18,11.86 133.18,11.7 133.64,11.25 U$3.1
  Bottom 0.152: N3.8 71,65.04 71.31,64.74 71.31,64.59 72.07,63.82 92.95,63.82 94.17,65.04 94.93,65.04 N4.8 95.08,65.2 95.39,65.5 95.39,65.65 96.15,66.41 114.74,66.41 115.81,65.35 124.8,65.35 124.95,65.2 N5.8 | N2.8 40.98,65.2 40.22,65.2 39.15,66.26 30.01,66.26 29.86,66.41 19.04,66.41 17.97,65.35 17.21,65.35 N1.8
9
  Bottom 0.152: N1.9 17.51,62.15 18.88,63.52 40.37,63.52 41.14,62.76 41.14,62.6 41.44,62.3 N2.9 41.59,62.3 42.35,62.3 43.57,63.52 69.79,63.52 71,62.3 71.31,62.3 N3.9 71.46,62.3 72.22,62.3 73.44,63.52 93.86,63.52 95.08,62.3 95.39,62.3 N4.9 95.54,62.3 96.46,62.3 97.98,60.78 122.21,60.78 122.97,60.01 | N6.9 149.34,62 149.03,62 148.42,61.39 138.21,61.39 137.6,60.78 127.09,60.78 125.72,62.15 125.41,62.15 N5.9 125.26,62.3 122.97,60.01 | 122.97,60.01 122.97,58.95 124.95,56.97 124.95,23.13 136.08,12.01 136.08,11.25 U$3.2
A  (via drill 0.35)
  Top 0.152: v99.81,32.89 94.17,32.89 91.88,35.17 88.68,35.17 86.4,32.89 U4.24 | v108.04,31.36 129.83,9.57 136.84,9.57 138.37,11.09 138.67,11.09 U$3.3
  Bottom 0.152: v99.81,32.89 101.64,32.89 103.16,31.36 v108.04,31.36
B  (via drill 0.35)
  Top 0.152: v85.48,38.53 81.83,38.53 79.23,35.93 79.23,35.63 79.39,35.48 79.39,34.41 U4.36 | v105.6,36.85 105.6,32.89 129.22,9.26 144.16,9.26 145.99,11.09 146.29,11.09 U$3.6
  Bottom 0.152: v85.48,38.53 96,38.53 98.28,36.24 104.99,36.24 v105.6,36.85
BAT+  (via drill 0.35)
  Top 0.152: 27.72,15.97 33.97,15.97 34.43,15.51 34.43,14.6 R13.2 | 27.72,15.97 26.5,14.75 23.91,14.75 23.15,13.99 23.15,13.23 C2.1 | 27.72,15.97 27.72,22.07 25.13,24.66 23.61,24.66 22.83,25.43
  Top 1.016: v27.8,42.4 20.4,42.4 19.1,41.1 19.1,35.14 | 19.1,35.14 L2.P1 | U2.5 19.5,22.1 22.83,25.43 23.3,25.9 23.3,30.94 19.1,35.14
  Bottom 1.016: U$2.B+ 31.35,38.85 v27.8,42.4
BAT-  (via drill 0.35)
  Top 0.152: 35.34,6.67 38.24,6.67 C5.1 38.39,6.67 39,6.67 39.76,5.91 39.76,5.61 40.07,5.3 42.35,5.3 47.38,10.33 v61.25,10.33 | 35.34,6.67 34.73,6.67 U3.3 | 35.34,6.67 35.34,7.28 34.89,7.74 33.36,7.74 32.75,8.35 32.75,8.96 U3.6
  Bottom 0.152: v61.25,10.33 67.35,10.33 79.39,22.37 95.85,22.37 98.89,25.42 106.51,25.42 119.93,38.83 120.54,38.83 U$2.B-
C  (via drill 0.35)
  Top 0.152: v92.34,18.26 84.87,25.72 U4.12
  Bottom 0.152: v92.34,18.26 119.93,18.26 128.92,9.26 146.75,9.26 148.58,11.09 148.88,11.09 U$3.7
D  (via drill 0.35)
  Top 0.152: v92.34,20.24 86.4,26.18 86.4,27.25 U4.13
  Bottom 0.152: v92.34,20.24 118.4,20.24 129.07,9.57 139.43,9.57 140.96,11.09 141.26,11.09 U$3.4
DOT
  Top 0.152: 44.03,51.79 44.03,38.53 46.47,36.09 46.93,36.09 OK7.4 | 44.03,51.79 38.24,57.58 N2.LHDP | 44.03,51.79 54.24,51.79 61.25,58.79 68.57,58.79 69.18,58.19 84.72,58.19 85.33,58.79 90.51,58.79 91.73,57.58 92.04,57.58 N4.LHDP
DTR  (via drill 0.35)
  Top 0.152: R222.1 53.33,18.56 53.33,17.8 54.7,16.43 54.7,15.21 Q2.3 54.7,15.06 v54.7,13.84
  Bottom 0.152: v54.7,13.84 54.7,7.44 55.46,6.67 55.46,5.76 JP1.5
EN  (via drill 0.35)
  Top 0.152: 49.82,12.01 49.82,14.6 49.67,14.75 C9.1 49.67,14.9 49.97,15.21 49.97,19.02 S2.2 | 49.82,12.01 49.82,11.86 R16.1 49.82,12.01 | 60.49,11.4 60.03,10.94 51.35,10.94 50.28,12.01 49.82,12.01 | 60.49,11.4 60.79,11.7 60.79,12.47 Q1.2 | v82.13,22.98 82.13,23.29 83.35,24.5 83.35,25.72 U4.9 | 60.49,11.4 v60.64,11.25
  Bottom 0.152: v82.13,22.98 72.38,22.98 v60.64,11.25
GND  (via drill 0.35)
  Top 0.152: ANT1.GND 79.3,10.49 C8.2 | v68.7,30 67.62,31.08 C10.2 | C6.2 104.03,33.03 v101.7,30.7
  Bottom 0.152: v68.7,30 68.72,30.02 U4.GND 82.14,30.09 84.44,30.09 85.06,30.7 v101.7,30.7
  pour Bottom: -0.4,80.3 155.5,80.3 155.5,-1.5 -0.4,-1.5
  pour Top: -1.9,81.6 158,81.6 158,-3.7 -1.9,-3.7
GPIO0
  Top 0.152: R17.1 53.02,22.83 53.02,21.15 51.8,19.93 51.8,12.47 53.02,11.25 55,11.25 55.61,11.86 55.61,12.47 Q2.2
HV
  Top 0.152: 137.3,42.95 117.03,42.95 114.59,45.38 114.59,46.45 OK5.4 114.44,46.6 100.72,46.6 96.46,50.87 89.29,50.87 85.18,46.76 84.57,46.76 OK4.4 84.42,46.6 83.96,46.6 82.59,45.23 69.02,45.23 67.5,46.76 60.64,46.76 OK3.4 60.49,46.6 60.03,46.6 47.99,34.56 46.01,34.56 33.82,46.76 30.62,46.76 OK2.4 30.47,46.6 29.86,46.6 28.49,45.23 15.07,45.23 13.55,46.76 6.54,46.76 OK1.4 | 137.3,42.95 138.67,44.32 138.67,46.6 OK6.4 | 137.3,42.95 R15.2
N$1
  Top 0.305: U1.VBUS1 8.23,20.59 R1.2
N$2
  Top 0.305: R2.2 7.01,17.99 U1.GND1 3.91,17.99 U1.GND
N$3
  Top 0.152: LED1.C 18.88,15.21 18.12,15.97 18.12,16.88 U2.3
N$4
  Top 0.152: LED1.A 18.88,9.42 18.88,6.52 19.04,6.37 R3.1
N$5
  Top 0.152: LED2.C 15.38,11.7 15.38,14.6 16.75,15.97 16.75,16.88 U2.2
N$6
  Top 0.152: U2.6 18.28,21.91 18.28,20.85 18.58,20.54 24.68,20.54 25.44,21.3 25.44,22.07 R5.2
N$7
  Top 0.152: U2.8 15.53,22.07 15.53,27.4 15.23,27.71 U$1.1 | C3.1 11.72,26.79 13.25,26.79 14.16,27.71 15.07,27.71 U$1.1 | U$1.1 15.07,27.86 15.07,34.72 L2.P2
N$8
  Top 0.152: U3.1 32.6,6.67 27.57,6.67 R12.1
N$9
  Top 0.152: 33.67,9.88 33.67,12.77 32.6,13.84 32.6,14.45 R13.1 | 33.67,9.88 33.67,9.11 U3.5 | 33.67,9.88 37.78,9.88 39.76,7.89 39.76,7.59 40.53,6.83 41.14,6.83 C5.2
N$10
  Top 0.152: ANT1.FEED 77.14,10.2 R26.2
N$11  (via drill 0.35)
  Top 0.152: v74.05,32.58 64.45,22.98 54.7,22.98 R17.2 | v89.14,34.56 88.23,33.65 88.23,32.89 87.62,32.28 86.4,32.28 U4.23
  Bottom 0.152: v74.05,32.58 74.66,32.58 78.93,36.85 81.83,36.85 82.89,35.78 93.1,35.78 93.41,35.48 93.41,34.87 93.1,34.56 v89.14,34.56
N$12
  Top 0.152: Q1.1 58.97,12.62 58.97,13.99 55.16,17.8 55.16,18.56 R222.2
N$13
  Top 0.152: IC1.4 38.85,29.69 39.15,29.69 40.37,28.47 40.37,28.16 41.14,27.4 41.74,27.4 C14.1
N$14
  Top 0.152: Q2.1 53.78,12.62 53.78,13.99 52.11,15.67 52.11,19.78 52.41,20.09 56.53,20.09 57.9,18.71 58.36,18.71 R333.2
N$15
  Top 0.152: C8.1 80.15,14.29 79.23,14.29 77.25,16.28 76.49,16.28 L1.2 76.34,16.43 76.34,17.04 79.84,20.54 79.84,24.05 79.69,24.2 79.69,24.35 79.84,24.5 79.84,25.72 U4.2
N$16
  Top 0.152: R26.1 74.66,11.09 74.66,13.23 74.21,13.68 C7.1 74.21,13.84 74.51,14.14 74.51,16.28 L1.1
N$17
  Top 0.152: IC3.14 119.01,38.37 119.01,36.85 124.8,31.06 125.87,31.06 126.48,30.45 126.48,15.67 127.24,14.9 127.24,14.45 BAT1.1
N$18
  Top 0.152: LED2.A 15.23,9.42 15.23,8.5 13.86,7.13 13.86,5.15 14.46,4.54 15.23,4.54 R4.1
N$19
  Top 0.152: R15.1 150.1,42.79 150.1,37.92 150.25,37.76 SV1.5
N$22
  Top 0.152: R6.1 19.04,48.74 18.58,48.74 17.51,47.67 17.51,47.52 16.75,46.76 16.14,46.76 OK1.1
N$23
  Top 0.152: R7.1 42.81,48.58 42.2,48.58 41.44,47.82 41.44,47.52 40.68,46.76 40.07,46.76 OK2.1
N$24
  Top 0.152: R8.1 72.83,48.58 72.22,48.58 71.46,47.82 71.46,47.52 70.7,46.76 70.09,46.76 OK3.1
N$25
  Top 0.152: R9.1 96.76,48.58 96.15,48.58 95.39,47.82 95.39,47.52 94.63,46.76 94.17,46.76 OK4.1
N$26
  Top 0.152: R10.1 126.94,48.58 126.48,48.58 124.5,46.6 124.04,46.6 OK5.1
N$27
  Top 0.152: R11.1 150.86,48.74 150.41,48.74 149.49,47.82 149.49,47.52 148.73,46.76 148.27,46.76 OK6.1
N$40
  Top 0.152: R20.2 60.19,36.24 56.83,36.24 56.68,36.09 OK7.1
OPC1  (via drill 0.35)
  Top 0.152: v29.1,47.21 19.19,47.21 R6.2 | v87.62,25.88 87.62,26.33 88.23,26.94 88.23,27.25 87.62,27.86 86.4,27.86 U4.14
  Bottom 0.152: v29.1,47.21 50.58,47.21 71.31,26.49 78.93,26.49 79.54,25.88 v87.62,25.88
OPC2  (via drill 0.35)
  Top 0.152: 84.96,28.27 U4.15 86.4,28.31 87.62,28.31 88.53,27.4 v88.53,25.88 | v43.42,45.84 42.96,46.3 42.96,46.91 R7.2
  Bottom 0.152: v43.42,45.84 51.5,45.84 74.05,23.29 81.52,23.29 83.5,25.27 87.92,25.27 v88.53,25.88
OPC3  (via drill 0.35)
  Top 0.152: v77.25,45.84 76.03,47.06 72.99,47.06 R8.2 | v89.75,29.84 v91.58,31.67 | v89.14,27.4 87.92,28.62 87.77,28.62 87.62,28.77 86.4,28.77 U4.16
  Bottom 0.152: v77.25,45.84 86.09,37 96.3,37 96.76,36.55 96.76,33.65 94.78,31.67 v91.58,31.67 | v89.75,29.84 88.53,28.62 88.53,28.01 v89.14,27.4
OPC4  (via drill 0.35)
  Top 0.152: v90.66,29.84 97.67,29.84 101.18,33.34 101.18,41.42 96.91,45.69 96.91,46.91 R9.2 | v89.14,28.31 88.23,29.23 88.07,29.23 87.92,29.38 87.77,29.38 87.62,29.23 86.4,29.23 U4.17
  Bottom 0.152: v89.14,28.31 v90.66,29.84
OPC5  (via drill 0.35)
  Top 0.152: v115.81,45.08 125.87,45.08 126.94,46.15 126.94,46.76 R10.2 | v102.09,33.34 97.67,28.92 88.99,28.92 88.23,29.69 86.4,29.69 U4.18
  Bottom 0.152: v115.81,45.08 104.08,33.34 v102.09,33.34
OPC6  (via drill 0.35)
  Top 0.152: v145.53,45.23 149.8,45.23 150.86,46.3 150.86,47.06 R11.2 | v136.69,41.73 111.39,41.73 v106.97,37.31 | v96.3,32.28 89.14,32.28 87.62,30.75 86.4,30.75 U4.20
  Bottom 0.152: v145.53,45.23 141.41,45.23 137.91,41.73 v136.69,41.73 | v106.97,37.31 103.62,33.95 97.98,33.95 v96.3,32.28
OPC7  (via drill 0.35)
  Top 0.152: v65.67,38.07 60.34,38.07 R20.1 | v88.84,33.34 88.84,32.43 87.62,31.21 86.4,31.21 U4.21
  Bottom 0.152: v65.67,38.07 71.77,31.97 74.51,31.97 76.19,33.65 88.53,33.65 v88.84,33.34
PSRAM_CLK  (via drill 0.35)
  Top 0.152: v96,35.17 99.96,35.17 U5.6 | v82.74,36.85 82.74,36.55 81.83,35.63 81.83,34.41 U4.31
  Bottom 0.152: v96,35.17 94.17,35.17 93.26,36.09 83.5,36.09 v82.74,36.85
PSRAM_CS  (via drill 0.35)
  Top 0.152: v96.76,38.68 95.85,37.76 94.93,37.76 U5.1 | v97.83,39.74 97.83,40.51 98.13,40.81 R14.1 98.13,40.96 98.13,41.27 97.07,42.34 90.21,42.34 85.79,37.92 85.64,37.92 83.96,36.24 83.5,36.24 82.89,35.63 82.89,34.41 U4.29
  Bottom 0.152: v97.83,39.74 v96.76,38.68
RTS
  Top 0.152: R333.1 60.19,18.56 59.88,18.26 59.88,15.21 Q1.3 59.88,15.06 60.34,15.06 61.86,13.53 61.86,10.03 58.2,6.37 58.2,5.76 JP1.6
RXD  (via drill 0.35)
  Top 0.152: v75.27,30.75 75.73,31.21 76.03,31.21 76.49,30.75 77.71,30.75 U4.41 | v63.54,23.59 v70.7,30.75
  Bottom 0.152: v75.27,30.75 74.66,30.75 74.36,30.45 71,30.45 v70.7,30.75 | v63.54,23.59 53.48,13.53 53.48,7.74 53.17,7.44 53.17,7.28 53.02,7.13 53.02,5.76 JP1.4
SCL  (via drill 0.35)
  Top 0.152: v96,21.61 95.69,21.3 95.69,4.85 U6.6 | v99.2,24.81 99.2,25.88 99.5,26.18 | 99.5,26.18 99.96,26.64 99.96,27.1 R19.1 | v114.59,36.55 116.42,38.37 IC3.16 | 99.5,26.18 v99.66,26.03 | v75.88,32.43 76.49,31.82 77.71,31.82 U4.39
  Bottom 0.152: v99.2,24.81 v96,21.61 | v114.59,36.55 113.83,35.78 113.83,35.63 104.23,26.03 102.4,26.03 | v99.66,26.03 102.4,26.03 | v75.88,32.43 78.32,32.43 79.23,33.34 87.92,33.34 90.21,31.06 101.18,31.06 101.48,31.36 101.94,31.36 102.4,30.91 102.4,26.03
SDA  (via drill 0.35)
  Top 0.152: 92.95,23.9 92.95,4.85 U6.1 | 92.95,23.9 95.85,26.79 95.85,27.25 R18.1 95.69,27.4 95.69,27.86 96.3,28.47 97.67,28.47 98.13,28.92 v103.01,28.92 | v113.22,35.93 116.72,35.93 117.64,36.85 117.64,38.37 IC3.15 | v75.27,29.38 75.58,29.38 76.49,30.3 77.71,30.3 U4.42 | 92.95,23.9 v92.8,24.05
  Bottom 0.152: v113.22,35.93 113.22,35.63 106.51,28.92 v103.01,28.92 | v75.27,29.38 76.49,29.38 79.39,26.49 90.36,26.49 v92.8,24.05
SIO0  (via drill 0.35)
  Top 0.152: v96.15,33.95 99.96,33.95 U5.5 | v80.61,36.24 80.61,35.78 80.76,35.63 80.76,34.41 U4.33
  Bottom 0.152: v96.15,33.95 82.89,33.95 v80.61,36.24
SIO1
  Top 0.152: U5.2 94.78,36.39 94.02,36.39 93.86,36.55 93.86,38.83 95.39,40.35 95.39,41.42 94.78,42.03 90.36,42.03 84.57,36.24 84.42,36.24 83.81,35.63 83.81,34.41 U4.27
SIO2  (via drill 0.35)
  Top 0.152: v92.8,35.17 94.78,35.17 U5.3 | v81.52,36.24 81.22,35.93 81.22,35.78 81.37,35.63 81.37,34.41 U4.32
  Bottom 0.152: v92.8,35.17 82.59,35.17 v81.52,36.24
SIO3  (via drill 0.35)
  Top 0.152: v96,36.39 99.96,36.39 U5.7 | v83.65,36.85 83.05,36.24 82.89,36.24 82.28,35.63 82.28,34.41 U4.30
  Bottom 0.152: v96,36.39 84.11,36.39 v83.65,36.85
T1
  Top 0.152: OK1.3 6.54,49.35 6.54,51.63 11.26,56.36 11.26,56.81 N1.A
T2
  Top 0.152: OK2.3 30.62,49.35 30.62,51.79 35.19,56.36 35.19,56.66 N2.A
T3
  Top 0.152: OK3.3 60.64,49.35 60.64,51.94 65.06,56.36 65.06,56.66 N3.A
T4
  Top 0.152: OK4.3 84.57,49.35 84.57,51.79 89.14,56.36 89.14,56.66 N4.A
T5
  Top 0.152: OK5.3 114.59,49.19 114.59,51.94 119.32,56.66 N5.A
T6
  Top 0.152: OK6.3 138.67,49.35 138.67,52.24 143.24,56.81 N6.A
TXD  (via drill 0.35)
  Top 0.152: v75.27,31.67 76.03,31.67 76.49,31.21 77.71,31.21 U4.40 | v74.05,31.06 74.05,17.95 62.17,6.06 62.17,4.39 61.25,3.47 52.11,3.47 50.58,5 50.58,5.61 JP1.3
  Bottom 0.152: v75.27,31.67 74.66,31.67 v74.05,31.06
VBUS
  Top 0.152: R4.2 15.38,6.22 16.45,6.22 18.28,4.39 19.04,4.39 R3.2 19.19,4.54 19.95,4.54 20.41,5 20.41,15.06 19.49,15.97 19.49,16.88 U2.4 | U2.4 19.65,17.04 23,17.04 C1.1 | R1.1 11.57,22.07 13.09,22.07 16.9,18.26 19.19,18.26 19.49,17.95 19.49,17.04 U2.4
VCC  (via drill 0.35)
  Top 0.152: 36.87,26.18 36.87,24.66 36.41,24.2 C12.1 36.41,24.05 36.41,23.29 v37.17,22.52 | 36.87,26.18 36.87,27.4 IC1.1 36.87,27.55 36.87,28.47 37.17,28.77 37.48,28.77 37.78,29.08 37.78,34.72 28.94,43.55 11.42,43.55 4.1,36.24 SW1.CH1A | 36.87,26.18 38.24,26.18 38.7,26.64 38.7,27.4 IC1.3 | v133.18,12.77 142.02,12.77 143.09,11.7 143.24,11.7 143.7,11.25 U$3.5
  Bottom 0.152: SV1.1 150.41,27.55 150.41,23.13 147.51,20.24 147.51,20.09 147.66,19.93 147.66,19.02 147.51,18.87 147.51,18.71 147.66,18.56 147.66,15.21 143.7,11.25 U$3.5 | v37.17,22.52 47.08,12.62 47.08,7.44 47.84,6.67 47.84,5.76 JP1.2 47.99,5.61 47.99,5.15 49.67,3.47 61.25,3.47 62.01,4.24 62.01,4.54 78.32,20.85 118.25,20.85 126.33,12.77 v133.18,12.77
VDD_SDIO
  Top 0.152: R25.2 94.47,40.96 89.75,40.96 84.42,35.63 84.42,34.41 U4.26

### Text on the board
tPlace: 20241016 / ESP32 IN14 Clock v2.0 / Tony Guo